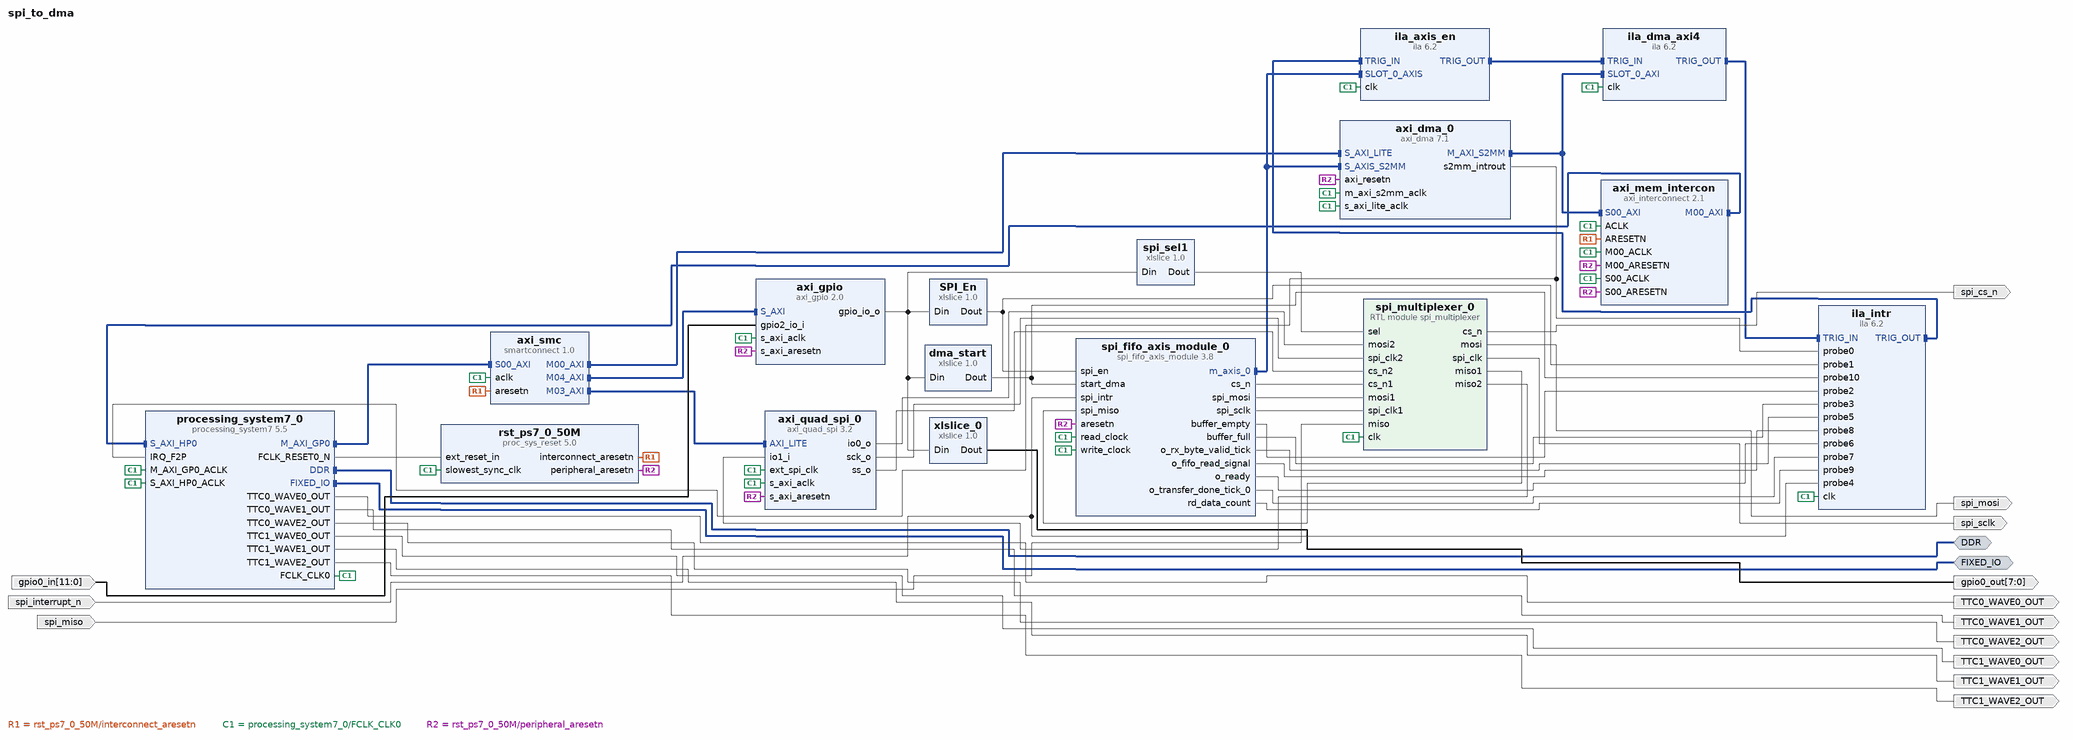
[diagram p0: block diagram of the top level]
# Vivado block design spi_to_dma, xc7z020clg400-1, Vivado 2024.2
create_bd_design spi_to_dma

create_bd_intf_port -mode Master -vlnv xilinx.com:interface:ddrx_rtl:1.0 DDR
create_bd_intf_port -mode Master -vlnv xilinx.com:display_processing_system7:fixedio_rtl:1.0 FIXED_IO
create_bd_port -dir I spi_miso
create_bd_port -dir I spi_interrupt_n
create_bd_port -dir O spi_mosi
create_bd_port -dir O -type clk spi_sclk
create_bd_port -dir O spi_cs_n
create_bd_port -dir O TTC0_WAVE0_OUT
create_bd_port -dir O TTC0_WAVE1_OUT
create_bd_port -dir O TTC0_WAVE2_OUT
create_bd_port -dir O TTC1_WAVE0_OUT
create_bd_port -dir O TTC1_WAVE1_OUT
create_bd_port -dir O TTC1_WAVE2_OUT
create_bd_port -dir O -from 7 -to 0 gpio0_out
create_bd_port -dir I -from 11 -to 0 gpio0_in

create_bd_cell -type ip -vlnv xilinx.com:ip:processing_system7:5.5 processing_system7_0
set_property -dict [list \
  CONFIG.PCW_APU_PERIPHERAL_FREQMHZ 667 \
  CONFIG.PCW_ENET0_ENET0_IO {MIO 16 .. 27} \
  CONFIG.PCW_ENET0_GRP_MDIO_ENABLE 1 \
  CONFIG.PCW_ENET0_GRP_MDIO_IO {MIO 52 .. 53} \
  CONFIG.PCW_ENET0_PERIPHERAL_ENABLE 1 \
  CONFIG.PCW_ENET0_RESET_ENABLE 0 \
  CONFIG.PCW_ENET_RESET_ENABLE 1 \
  CONFIG.PCW_ENET_RESET_SELECT {Share reset pin} \
  CONFIG.PCW_FPGA0_PERIPHERAL_FREQMHZ 50 \
  CONFIG.PCW_GPIO_MIO_GPIO_ENABLE 1 \
  CONFIG.PCW_GPIO_MIO_GPIO_IO MIO \
  CONFIG.PCW_I2C_RESET_ENABLE 1 \
  CONFIG.PCW_IRQ_F2P_INTR 1 \
  CONFIG.PCW_PRESET_BANK1_VOLTAGE {LVCMOS 1.8V} \
  CONFIG.PCW_QSPI_GRP_FBCLK_ENABLE 1 \
  CONFIG.PCW_QSPI_GRP_FBCLK_IO {MIO 8} \
  CONFIG.PCW_QSPI_GRP_SINGLE_SS_ENABLE 1 \
  CONFIG.PCW_QSPI_GRP_SINGLE_SS_IO {MIO 1 .. 6} \
  CONFIG.PCW_QSPI_PERIPHERAL_ENABLE 1 \
  CONFIG.PCW_QSPI_QSPI_IO {MIO 1 .. 6} \
  CONFIG.PCW_SD0_GRP_CD_ENABLE 1 \
  CONFIG.PCW_SD0_GRP_CD_IO {MIO 47} \
  CONFIG.PCW_SD0_GRP_WP_ENABLE 0 \
  CONFIG.PCW_SD0_PERIPHERAL_ENABLE 1 \
  CONFIG.PCW_SD0_SD0_IO {MIO 40 .. 45} \
  CONFIG.PCW_SDIO_PERIPHERAL_FREQMHZ 50 \
  CONFIG.PCW_SINGLE_QSPI_DATA_MODE x4 \
  CONFIG.PCW_TTC0_PERIPHERAL_ENABLE 1 \
  CONFIG.PCW_TTC0_TTC0_IO EMIO \
  CONFIG.PCW_TTC1_PERIPHERAL_ENABLE 1 \
  CONFIG.PCW_TTC1_TTC1_IO EMIO \
  CONFIG.PCW_UART1_PERIPHERAL_ENABLE 1 \
  CONFIG.PCW_UART1_UART1_IO {MIO 48 .. 49} \
  CONFIG.PCW_UART_PERIPHERAL_FREQMHZ 100 \
  CONFIG.PCW_UIPARAM_DDR_FREQ_MHZ 533.333333 \
  CONFIG.PCW_UIPARAM_DDR_MEMORY_TYPE {DDR 3 (Low Voltage)} \
  CONFIG.PCW_UIPARAM_DDR_PARTNO {MT41K256M16 RE-125} \
  CONFIG.PCW_USB0_PERIPHERAL_ENABLE 1 \
  CONFIG.PCW_USB0_RESET_ENABLE 1 \
  CONFIG.PCW_USB0_RESET_IO {MIO 46} \
  CONFIG.PCW_USB0_USB0_IO {MIO 28 .. 39} \
  CONFIG.PCW_USB_RESET_ENABLE 1 \
  CONFIG.PCW_USB_RESET_SELECT {Share reset pin} \
  CONFIG.PCW_USE_FABRIC_INTERRUPT 1 \
  CONFIG.PCW_USE_S_AXI_HP0 1 \
] [get_bd_cells processing_system7_0]
# 302 more settings of processing_system7_0 are not shown: defaults, MIO pin electricals, DDR timing, and values the tool derives
create_bd_cell -type ip -vlnv xilinx.com:ip:axi_dma:7.1 axi_dma_0
set_property -dict {CONFIG.c_include_mm2s 0 CONFIG.c_include_sg 0 CONFIG.c_s2mm_burst_size 16} [get_bd_cells axi_dma_0]
create_bd_cell -type ip -vlnv xilinx.com:ip:smartconnect:1.0 axi_smc
set_property -dict {CONFIG.NUM_MI 6 CONFIG.NUM_SI 1} [get_bd_cells axi_smc]
create_bd_cell -type ip -vlnv xilinx.com:ip:proc_sys_reset:5.0 rst_ps7_0_50M
create_bd_cell -type ip -vlnv xilinx.com:ip:axi_interconnect:2.1 axi_mem_intercon
set_property -dict {CONFIG.NUM_MI 1} [get_bd_cells axi_mem_intercon]
create_bd_cell -type module -reference spi_multiplexer spi_multiplexer_0
create_bd_cell -type ip -vlnv xilinx.com:ip:axi_quad_spi:3.2 axi_quad_spi_0
set_property -dict [list \
  CONFIG.C_FIFO_DEPTH 256 \
  CONFIG.C_USE_STARTUP 0 \
  CONFIG.C_XIP_MODE 0 \
  CONFIG.FIFO_INCLUDED 1 \
  CONFIG.Master_mode 1 \
] [get_bd_cells axi_quad_spi_0]
create_bd_cell -type ip -vlnv xilinx.com:ip:axi_gpio:2.0 axi_gpio
set_property -dict [list \
  CONFIG.C_ALL_INPUTS_2 1 \
  CONFIG.C_ALL_OUTPUTS 1 \
  CONFIG.C_GPIO2_WIDTH 12 \
  CONFIG.C_GPIO_WIDTH 11 \
  CONFIG.C_IS_DUAL 1 \
] [get_bd_cells axi_gpio]
create_bd_cell -type ip -vlnv xilinx.com:ip:ila:6.2 ila_dma_axi4
set_property -dict [list \
  CONFIG.C_DATA_DEPTH 16384 \
  CONFIG.C_SLOT_0_AXI_PROTOCOL AXI4 \
  CONFIG.C_TRIGIN_EN true \
  CONFIG.C_TRIGOUT_EN true \
] [get_bd_cells ila_dma_axi4]
create_bd_cell -type ip -vlnv xilinx.com:ip:ila:6.2 ila_intr
set_property -dict [list \
  CONFIG.C_DATA_DEPTH 16384 \
  CONFIG.C_MONITOR_TYPE Native \
  CONFIG.C_NUM_OF_PROBES 11 \
  CONFIG.C_PROBE9_WIDTH 8 \
  CONFIG.C_TRIGIN_EN true \
  CONFIG.C_TRIGOUT_EN true \
] [get_bd_cells ila_intr]
create_bd_cell -type ip -vlnv xilinx.com:ip:ila:6.2 ila_axis_en
set_property -dict [list \
  CONFIG.C_DATA_DEPTH 16384 \
  CONFIG.C_SLOT_0_AXI_PROTOCOL AXI4S \
  CONFIG.C_TRIGIN_EN true \
  CONFIG.C_TRIGOUT_EN true \
] [get_bd_cells ila_axis_en]
create_bd_cell -type ip -vlnv xilinx.com:ip:xlslice:1.0 xlslice_0
set_property -dict {CONFIG.DIN_FROM 7 CONFIG.DIN_WIDTH 11} [get_bd_cells xlslice_0]
create_bd_cell -type ip -vlnv xilinx.com:ip:xlslice:1.0 spi_sel1
set_property -dict {CONFIG.DIN_FROM 9 CONFIG.DIN_TO 9 CONFIG.DIN_WIDTH 11} [get_bd_cells spi_sel1]
create_bd_cell -type ip -vlnv xilinx.com:ip:xlslice:1.0 SPI_En
set_property -dict {CONFIG.DIN_FROM 10 CONFIG.DIN_TO 10 CONFIG.DIN_WIDTH 11} [get_bd_cells SPI_En]
create_bd_cell -type ip -vlnv xilinx.com:user:spi_fifo_axis_module:3.8 spi_fifo_axis_module_0
create_bd_cell -type ip -vlnv xilinx.com:ip:xlslice:1.0 dma_start
set_property -dict {CONFIG.DIN_FROM 8 CONFIG.DIN_TO 8 CONFIG.DIN_WIDTH 11} [get_bd_cells dma_start]

# ---- connections ----

connect_bd_intf_net [get_bd_intf_pins axi_dma_0/M_AXI_S2MM] [get_bd_intf_pins axi_mem_intercon/S00_AXI]
connect_bd_intf_net [get_bd_intf_pins axi_dma_0/M_AXI_S2MM] [get_bd_intf_pins ila_dma_axi4/SLOT_0_AXI]
connect_bd_intf_net [get_bd_intf_pins axi_mem_intercon/M00_AXI] [get_bd_intf_pins processing_system7_0/S_AXI_HP0]
connect_bd_intf_net [get_bd_intf_pins axi_smc/M00_AXI] [get_bd_intf_pins axi_dma_0/S_AXI_LITE]
connect_bd_intf_net [get_bd_intf_pins axi_smc/M03_AXI] [get_bd_intf_pins axi_quad_spi_0/AXI_LITE]
connect_bd_intf_net [get_bd_intf_pins axi_smc/M04_AXI] [get_bd_intf_pins axi_gpio/S_AXI]
connect_bd_intf_net [get_bd_intf_pins ila_axis_en/TRIG_OUT] [get_bd_intf_pins ila_dma_axi4/TRIG_IN]
connect_bd_intf_net [get_bd_intf_pins ila_dma_axi4/TRIG_OUT] [get_bd_intf_pins ila_intr/TRIG_IN]
connect_bd_intf_net [get_bd_intf_pins ila_intr/TRIG_OUT] [get_bd_intf_pins ila_axis_en/TRIG_IN]
connect_bd_intf_net [get_bd_intf_ports DDR] [get_bd_intf_pins processing_system7_0/DDR]
connect_bd_intf_net [get_bd_intf_ports FIXED_IO] [get_bd_intf_pins processing_system7_0/FIXED_IO]
connect_bd_intf_net [get_bd_intf_pins processing_system7_0/M_AXI_GP0] [get_bd_intf_pins axi_smc/S00_AXI]
connect_bd_intf_net [get_bd_intf_pins axi_dma_0/S_AXIS_S2MM] [get_bd_intf_pins spi_fifo_axis_module_0/m_axis_0]
connect_bd_intf_net [get_bd_intf_pins axi_dma_0/S_AXIS_S2MM] [get_bd_intf_pins ila_axis_en/SLOT_0_AXIS]
connect_bd_net -net ARESETN_1 [get_bd_pins rst_ps7_0_50M/interconnect_aresetn] [get_bd_pins axi_mem_intercon/ARESETN] [get_bd_pins axi_smc/aresetn]
connect_bd_net [get_bd_pins axi_dma_0/s2mm_introut] [get_bd_pins processing_system7_0/IRQ_F2P] [get_bd_pins ila_intr/probe0]
connect_bd_net -net axi_gpio_0_gpio_io_o1 [get_bd_pins axi_gpio/gpio_io_o] \
  [get_bd_pins xlslice_0/Din] [get_bd_pins SPI_En/Din] [get_bd_pins spi_sel1/Din] [get_bd_pins dma_start/Din]
connect_bd_net [get_bd_pins axi_quad_spi_0/io0_o] [get_bd_pins spi_multiplexer_0/mosi2]
connect_bd_net [get_bd_pins axi_quad_spi_0/sck_o] [get_bd_pins spi_multiplexer_0/spi_clk2]
connect_bd_net [get_bd_pins axi_quad_spi_0/ss_o] [get_bd_pins spi_multiplexer_0/cs_n2]
connect_bd_net -net axis_enable_gpio_io_o [get_bd_pins SPI_En/Dout] [get_bd_pins ila_intr/probe1] [get_bd_pins spi_fifo_axis_module_0/spi_en]
connect_bd_net [get_bd_pins dma_start/Dout] [get_bd_pins spi_fifo_axis_module_0/start_dma] [get_bd_pins ila_intr/probe10]
connect_bd_net -net gpio2_io_i_0_1 [get_bd_ports gpio0_in] [get_bd_pins axi_gpio/gpio2_io_i]
connect_bd_net [get_bd_pins processing_system7_0/FCLK_CLK0] \
  [get_bd_pins processing_system7_0/M_AXI_GP0_ACLK] [get_bd_pins axi_smc/aclk] [get_bd_pins axi_dma_0/s_axi_lite_aclk] \
  [get_bd_pins rst_ps7_0_50M/slowest_sync_clk] [get_bd_pins axi_dma_0/m_axi_s2mm_aclk] \
  [get_bd_pins axi_mem_intercon/S00_ACLK] [get_bd_pins processing_system7_0/S_AXI_HP0_ACLK] \
  [get_bd_pins axi_mem_intercon/M00_ACLK] [get_bd_pins axi_mem_intercon/ACLK] [get_bd_pins axi_quad_spi_0/ext_spi_clk] \
  [get_bd_pins axi_quad_spi_0/s_axi_aclk] [get_bd_pins axi_gpio/s_axi_aclk] [get_bd_pins spi_multiplexer_0/clk] \
  [get_bd_pins ila_intr/clk] [get_bd_pins ila_dma_axi4/clk] [get_bd_pins ila_axis_en/clk] \
  [get_bd_pins spi_fifo_axis_module_0/read_clock] [get_bd_pins spi_fifo_axis_module_0/write_clock]
connect_bd_net [get_bd_pins processing_system7_0/FCLK_RESET0_N] [get_bd_pins rst_ps7_0_50M/ext_reset_in]
connect_bd_net [get_bd_pins processing_system7_0/TTC0_WAVE0_OUT] [get_bd_ports TTC0_WAVE0_OUT]
connect_bd_net [get_bd_pins processing_system7_0/TTC0_WAVE1_OUT] [get_bd_ports TTC0_WAVE1_OUT]
connect_bd_net [get_bd_pins processing_system7_0/TTC0_WAVE2_OUT] [get_bd_ports TTC0_WAVE2_OUT]
connect_bd_net [get_bd_pins processing_system7_0/TTC1_WAVE0_OUT] [get_bd_ports TTC1_WAVE0_OUT]
connect_bd_net [get_bd_pins processing_system7_0/TTC1_WAVE1_OUT] [get_bd_ports TTC1_WAVE1_OUT]
connect_bd_net [get_bd_pins processing_system7_0/TTC1_WAVE2_OUT] [get_bd_ports TTC1_WAVE2_OUT]
connect_bd_net [get_bd_pins rst_ps7_0_50M/peripheral_aresetn] \
  [get_bd_pins axi_dma_0/axi_resetn] [get_bd_pins axi_mem_intercon/S00_ARESETN] [get_bd_pins axi_mem_intercon/M00_ARESETN] \
  [get_bd_pins axi_quad_spi_0/s_axi_aresetn] [get_bd_pins axi_gpio/s_axi_aresetn] \
  [get_bd_pins spi_fifo_axis_module_0/aresetn]
connect_bd_net [get_bd_pins spi_fifo_axis_module_0/buffer_empty] [get_bd_pins ila_intr/probe2]
connect_bd_net [get_bd_pins spi_fifo_axis_module_0/buffer_full] [get_bd_pins ila_intr/probe3]
connect_bd_net [get_bd_pins spi_fifo_axis_module_0/cs_n] [get_bd_pins spi_multiplexer_0/cs_n1]
connect_bd_net -net spi_fifo_axis_module_0_o_byte_done_tick [get_bd_pins spi_fifo_axis_module_0/o_rx_byte_valid_tick] [get_bd_pins ila_intr/probe5]
connect_bd_net -net spi_fifo_axis_module_0_o_fifo_read_en [get_bd_pins spi_fifo_axis_module_0/o_fifo_read_signal] [get_bd_pins ila_intr/probe8]
connect_bd_net [get_bd_pins spi_fifo_axis_module_0/o_ready] [get_bd_pins ila_intr/probe6]
connect_bd_net [get_bd_pins spi_fifo_axis_module_0/o_transfer_done_tick_0] [get_bd_pins ila_intr/probe7]
connect_bd_net [get_bd_pins spi_fifo_axis_module_0/rd_data_count] [get_bd_pins ila_intr/probe9]
connect_bd_net [get_bd_pins spi_fifo_axis_module_0/spi_mosi] [get_bd_pins spi_multiplexer_0/mosi1]
connect_bd_net [get_bd_pins spi_fifo_axis_module_0/spi_sclk] [get_bd_pins spi_multiplexer_0/spi_clk1]
connect_bd_net -net spi_interrupt_0_1 [get_bd_ports spi_interrupt_n] [get_bd_pins ila_intr/probe4] [get_bd_pins spi_fifo_axis_module_0/spi_intr]
connect_bd_net -net spi_miso_0_1 [get_bd_ports spi_miso] [get_bd_pins spi_multiplexer_0/miso]
connect_bd_net [get_bd_pins spi_multiplexer_0/cs_n] [get_bd_ports spi_cs_n]
connect_bd_net [get_bd_pins spi_multiplexer_0/miso1] [get_bd_pins spi_fifo_axis_module_0/spi_miso]
connect_bd_net [get_bd_pins spi_multiplexer_0/miso2] [get_bd_pins axi_quad_spi_0/io1_i]
connect_bd_net [get_bd_pins spi_multiplexer_0/mosi] [get_bd_ports spi_mosi]
connect_bd_net [get_bd_pins spi_multiplexer_0/spi_clk] [get_bd_ports spi_sclk]
connect_bd_net [get_bd_pins xlslice_0/Dout] [get_bd_ports gpio0_out]
connect_bd_net -net xlslice_1_Dout [get_bd_pins spi_sel1/Dout] [get_bd_pins spi_multiplexer_0/sel]

# ---- address map ----
assign_bd_address -offset 0x00000000 -range 1G -target_address_space [get_bd_addr_spaces axi_dma_0/Data_S2MM] [get_bd_addr_segs processing_system7_0/S_AXI_HP0/HP0_DDR_LOWOCM]
assign_bd_address -offset 0x40400000 -range 64K -target_address_space [get_bd_addr_spaces processing_system7_0/Data] [get_bd_addr_segs axi_dma_0/S_AXI_LITE/Reg]
assign_bd_address -offset 0x41220000 -range 64K -target_address_space [get_bd_addr_spaces processing_system7_0/Data] [get_bd_addr_segs axi_gpio/S_AXI/Reg]
assign_bd_address -offset 0x41E00000 -range 64K -target_address_space [get_bd_addr_spaces processing_system7_0/Data] [get_bd_addr_segs axi_quad_spi_0/AXI_LITE/Reg]

validate_bd_design
save_bd_design
